# EasyEDA Pro project _MUSIC L VOICE R_2026-11-20.epro

# Schematic Schematic1
Board Name: Board1; Create Date: 2024-11-15; Page Name: P1; Project Name: MUSIC L VOICE R; Schematic Name: Schematic1; Update Date: 2024-11-15; Company: EasyEDA.com; Drawn: EasyEDA; Page Size: A4; Part Number: JLCPCB-002; Reviewed: EasyEDA; Version: V0.1
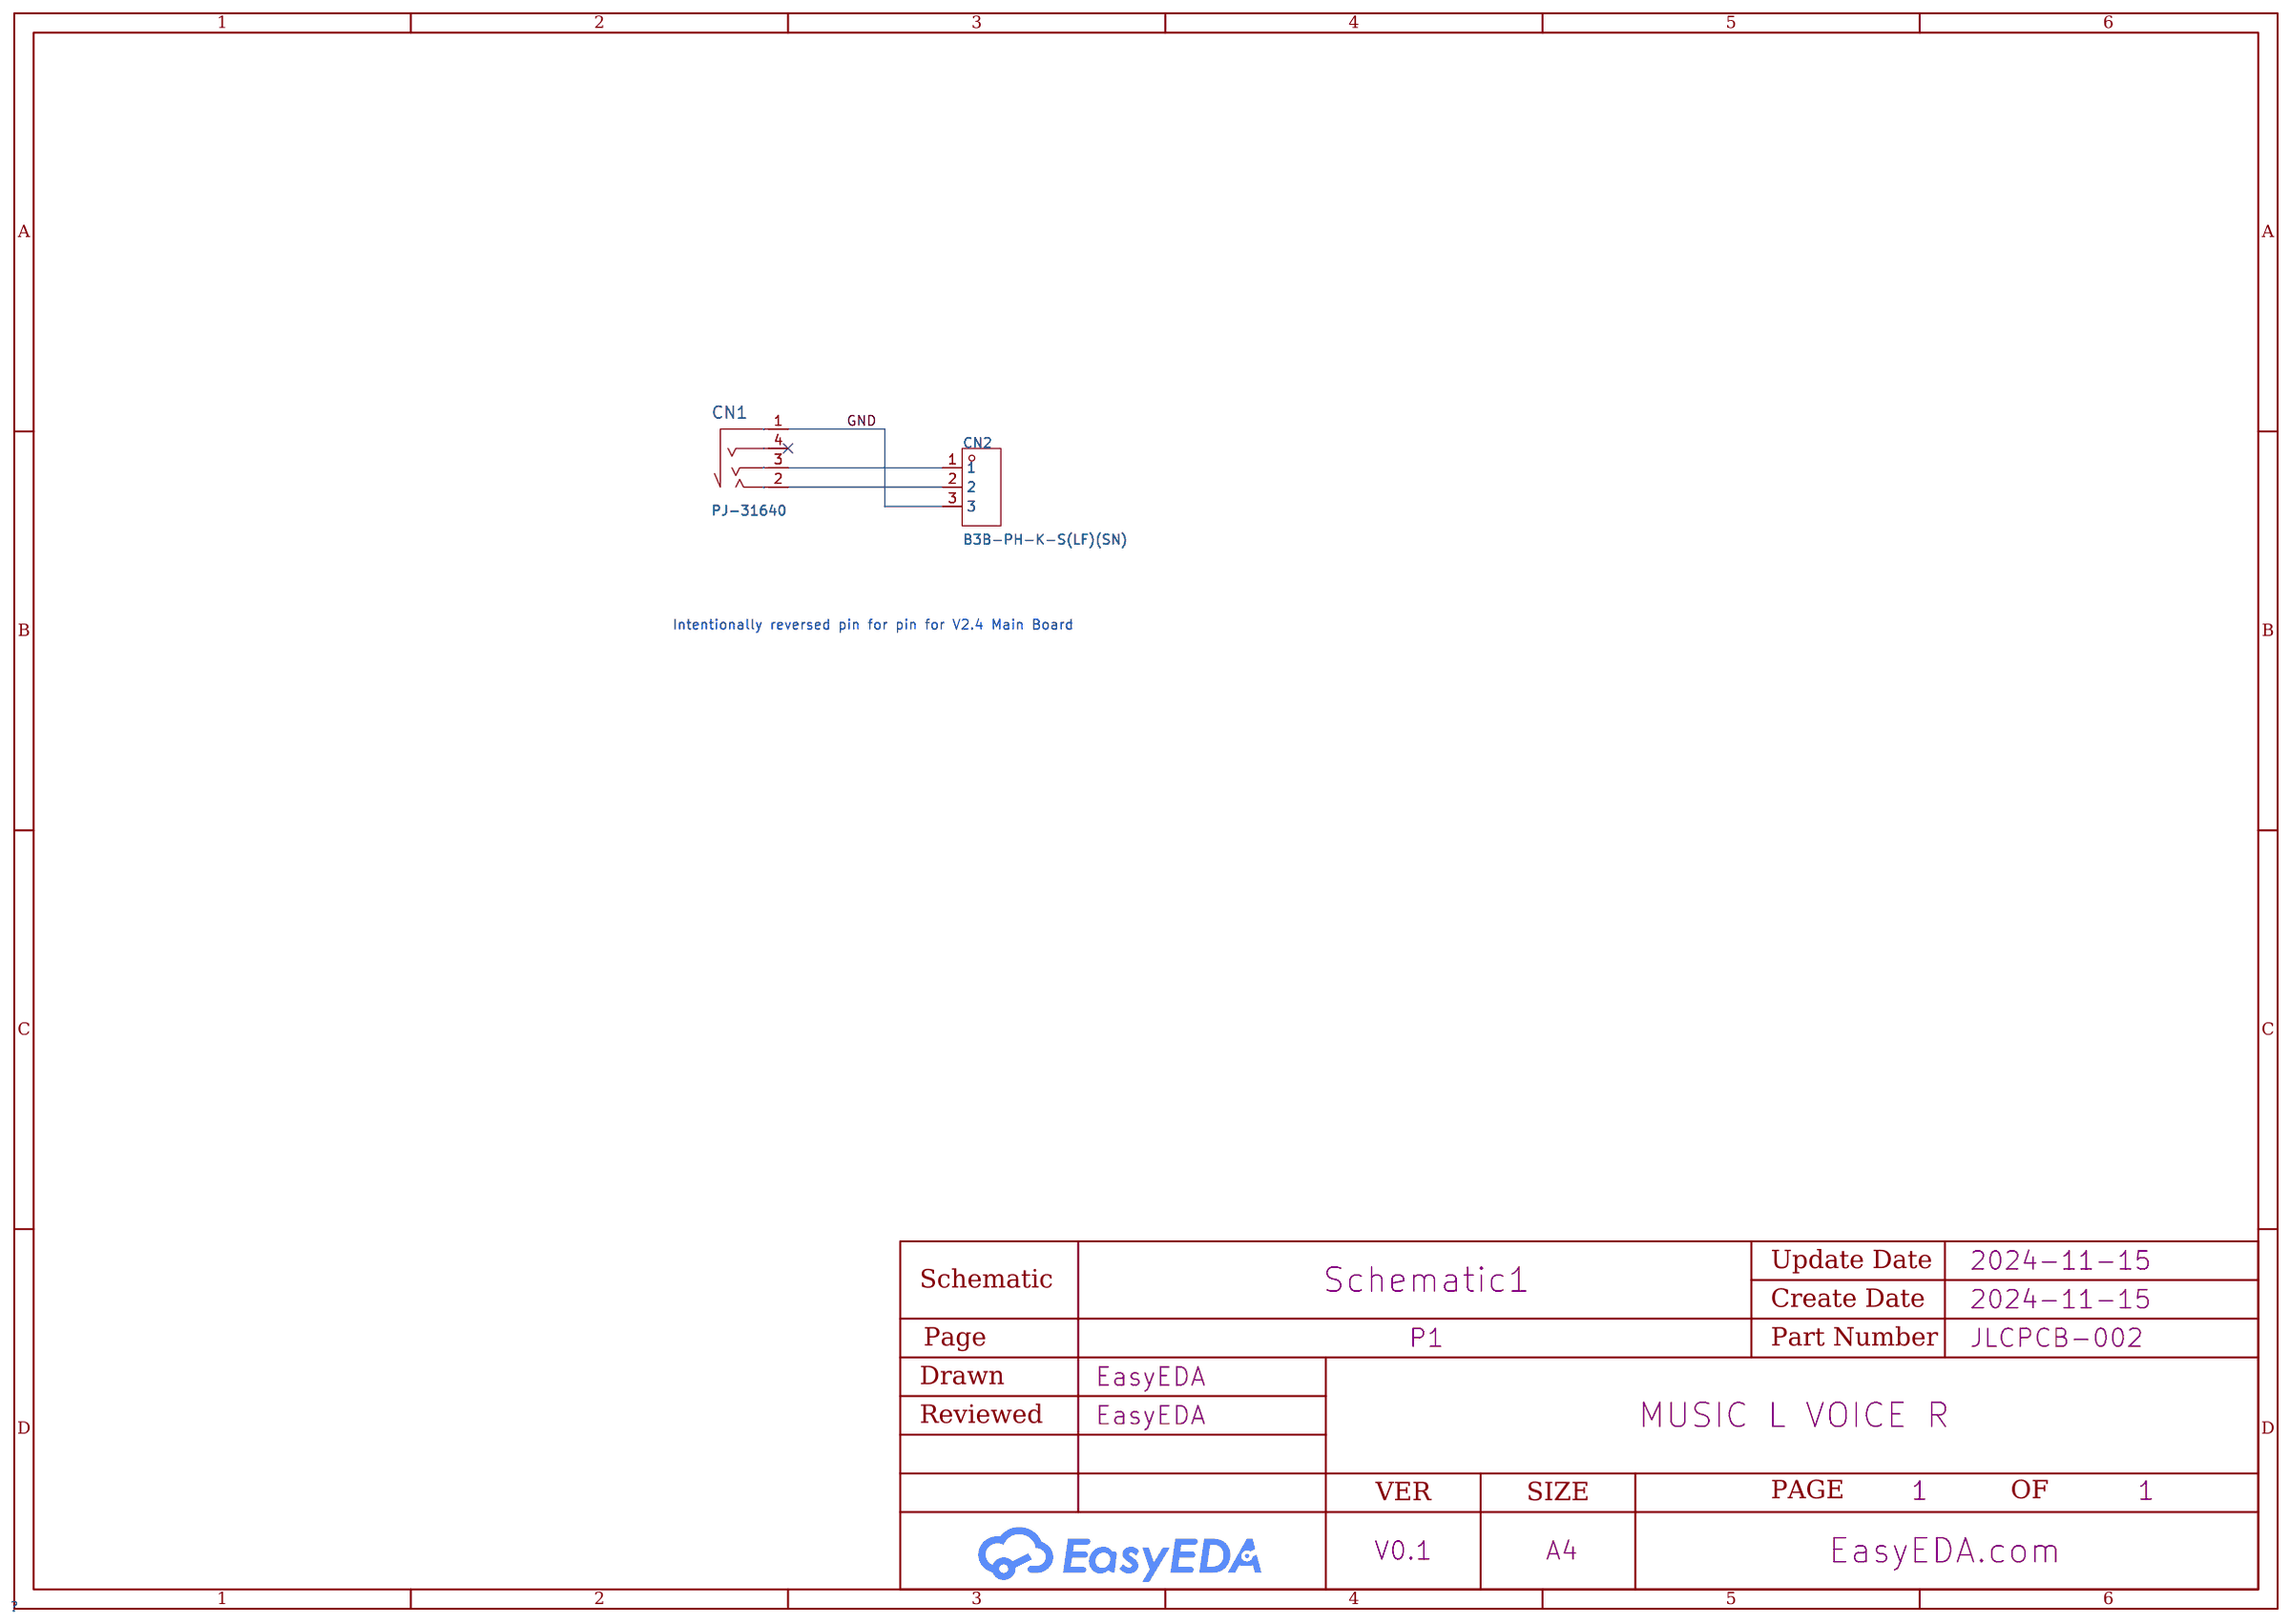
[diagram p0: schematic sheet]

## Parts
CN1  PJ-31640  [AUDIO-TH_XKB_PJ-31640]
CN2  B3B-PH-K-S(LF)(SN)  [CONN-TH_B3B-PH-K-S]

## Library data of the parts
CN1 = PJ-31640: Connector Type:3.5mm耳机座 Current Rating (Max):500mA Voltage Rating (Max):30V Operating Temperature Range:-20℃~+70℃ Operating Temperature Range:-20℃~+70℃ Soldering Temperature(Max):235℃; LCSC Part Name: 3.5mm耳机座; Supplier Part: C2879830; Manufacturer: XKB Connectivity(中国星坤); Supplier Footprint: 插件; JLCPCB Part Class: Extended Part; Datasheet: https://atta.szlcsc.com/upload/public/pdf/source/20210902/E3772AA4B361BDF8376D7D18611F7BA0.pdf; Supplier: LCSC; Connector Type: 3.5mm耳机座; Current Rating (Max): 500mA; Voltage Rating (Max): 30V; Operating Temperature Range: -20℃~+70℃; Soldering Temperature(Max): 235℃
CN2 = B3B-PH-K-S(LF)(SN): Pins Structure:1x3P Pitch:2mm Mounting Style:Straight Reference Series:PH Number of Pins:3P Number of Rows:1 Number of PINs Per Row:3 Row Spacing:- Current Rating (Max):2A Contact Material:Brass Contact Plating:Tin Operating Temperature Range:-25℃~+85℃ Op; LCSC Part Name: 1x3P 间距:2mm 直插 系列:PH; Supplier Part: C131339; Manufacturer: JST; Supplier Footprint: 插件,P=2mm; JLCPCB Part Class: Extended Part; Datasheet: https://atta.szlcsc.com/upload/public/pdf/source/20171026/C131342_15089839687311058815.pdf; Supplier: LCSC; Pins Structure: 1x3P; Pitch: 2mm; Mounting Style: Straight; Reference Series: PH; Number of Pins: 3P; Number of Rows: 1; Number of PINs Per Row: 3; Current Rating (Max): 2A; Contact Material: Brass; Contact Plating: Tin; Operating Temperature Range: -25℃~+85℃; Rated Voltage (Max): 100V; Plastic Material: PA66; Flame Retardant Rating: UL94V-0; Supplementary Features: 打K脚; Colour: White; Z-Height of the Board: 6mm; X-Length of Bottom Edge on Board (Spacing Line): 7.9mm; Y-Width of Bottom Edge on Board: 4.5mm

## Nets
GND: CN1.1 CN2.3
$1N236: CN1.2 CN2.2
$1N243: CN1.3 CN2.1

Not connected (* = marked no-connect by the designer): CN1 4*

## Notes on the sheet
- Intentionally reversed pin for pin for V2.4 Main Board

# Board PCB1
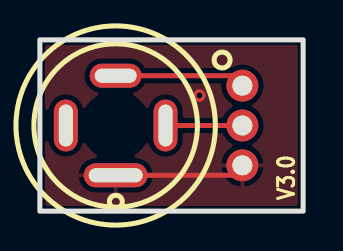
[diagram p1: board, top side]
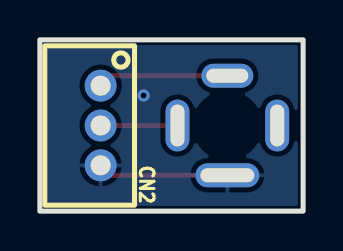
[diagram p2: board, bottom side, seen from below]

Outline 13.2 x 8.6 mm; copper layers: Top Layer, Bottom Layer. Coordinates in mm from the lower left corner of the outline.
Outline path: rectangle 0,8.6 13.2,0
Stack: Top Layer 0.035mm / Dielectric1 1.51mm FR4 er 4.5 / Bottom Layer 0.035mm

## Design rules (mm)
template: JLCPCB Capability(Two Layers Board)
spacing copperThickness1oz (default): track to track 0.102, other pairs 0.152 to 0.3
spacing copperThickness2oz: track to track 0.203, other pairs 0.152 to 0.3
track width copperThickness1oz (default): min 0.127, default 0.254, max 2.54
track width copperThickness2oz: min 0.203, default 0.254, max 2.54
differential pair differentialPair (default): width min 0.127, default 0.254, max 2.54; gap min 0.152, default 0.152
via viaSize (default): diameter min 0.5, default 0.61, max 10; hole min 0.3, default 0.305, max 6.3

## Placement (name value [footprint] x y rotation side)
CN1  PJ-31640  [AUDIO-TH_XKB_PJ-31640]  3.8 4.3 0 top
CN2  B3B-PH-K-S(LF)(SN)  [CONN-TH_B3B-PH-K-S]  10.15 4.3 90 bottom

## Footprints (pads in the part's own frame, mm; a bottom-side part is the same pattern mirrored in y, then rotated)
AUDIO-TH_XKB_PJ-31640
  oval 3.2x1.2 hole 2.7x0.7: 1(0,-2.5)
  oval 1.2x2.6 hole 0.7x2.1: 2(2.5,0) 4(-2.5,0)
  oval 2.6x1.2 hole 2.1x0.7: 3(0,2.5)
CONN-TH_B3B-PH-K-S
  round 1.6 hole 1: 1(2,0) 2(0,0) 3(-2,0)

## Nets
As in the schematic.

Pads without a net: CN1 4

## Via types
v1: diameter 0.61, hole 0.305, Top Layer to Bottom Layer, 1 via

## Routing (per net, layer and track width the routed paths; a pad name or vN(x,y) marks a point on that pad's centre or on a via; arc(x,y) is an arc through that point)
GND: length 6.6
  Top Layer w0.254: CN2.3 9.65,1.8 CN1.1
  vias: v1(8,5.81)
$1N236: length 3.9
  Top Layer w0.254: CN1.2 CN2.2
$1N243: length 6.6
  Top Layer w0.254: CN2.1 9.65,6.8 CN1.3

## Copper pours and planes (outline as drawn; the poured copper is in the pictures)
GND on Top Layer: 0,8.6 13.2,8.6 13.2,0 0,0
GND on Bottom Layer: 0,8.6 13.2,8.6 13.2,0 0,0

## Text on the board
Top Silkscreen Layer: V3.0
